# EAGLE board cyclops (EAGLE 6.5.0)
PCB: Cyclops r3.1; REVISION: 3.1
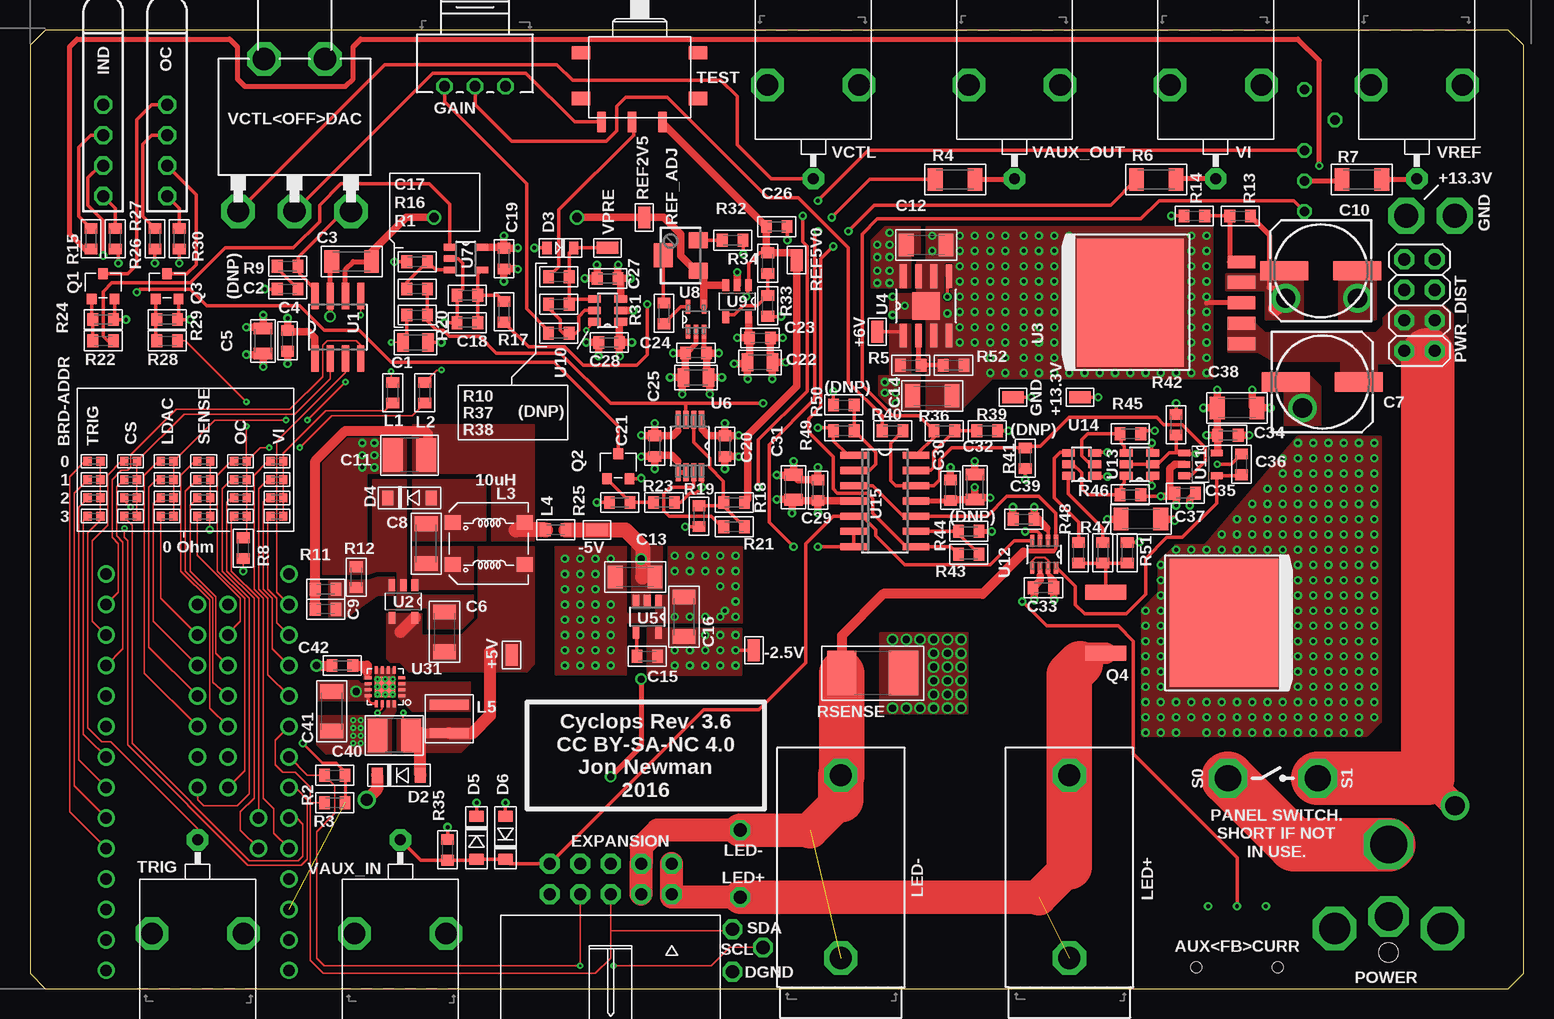
[diagram p5: board, top side]
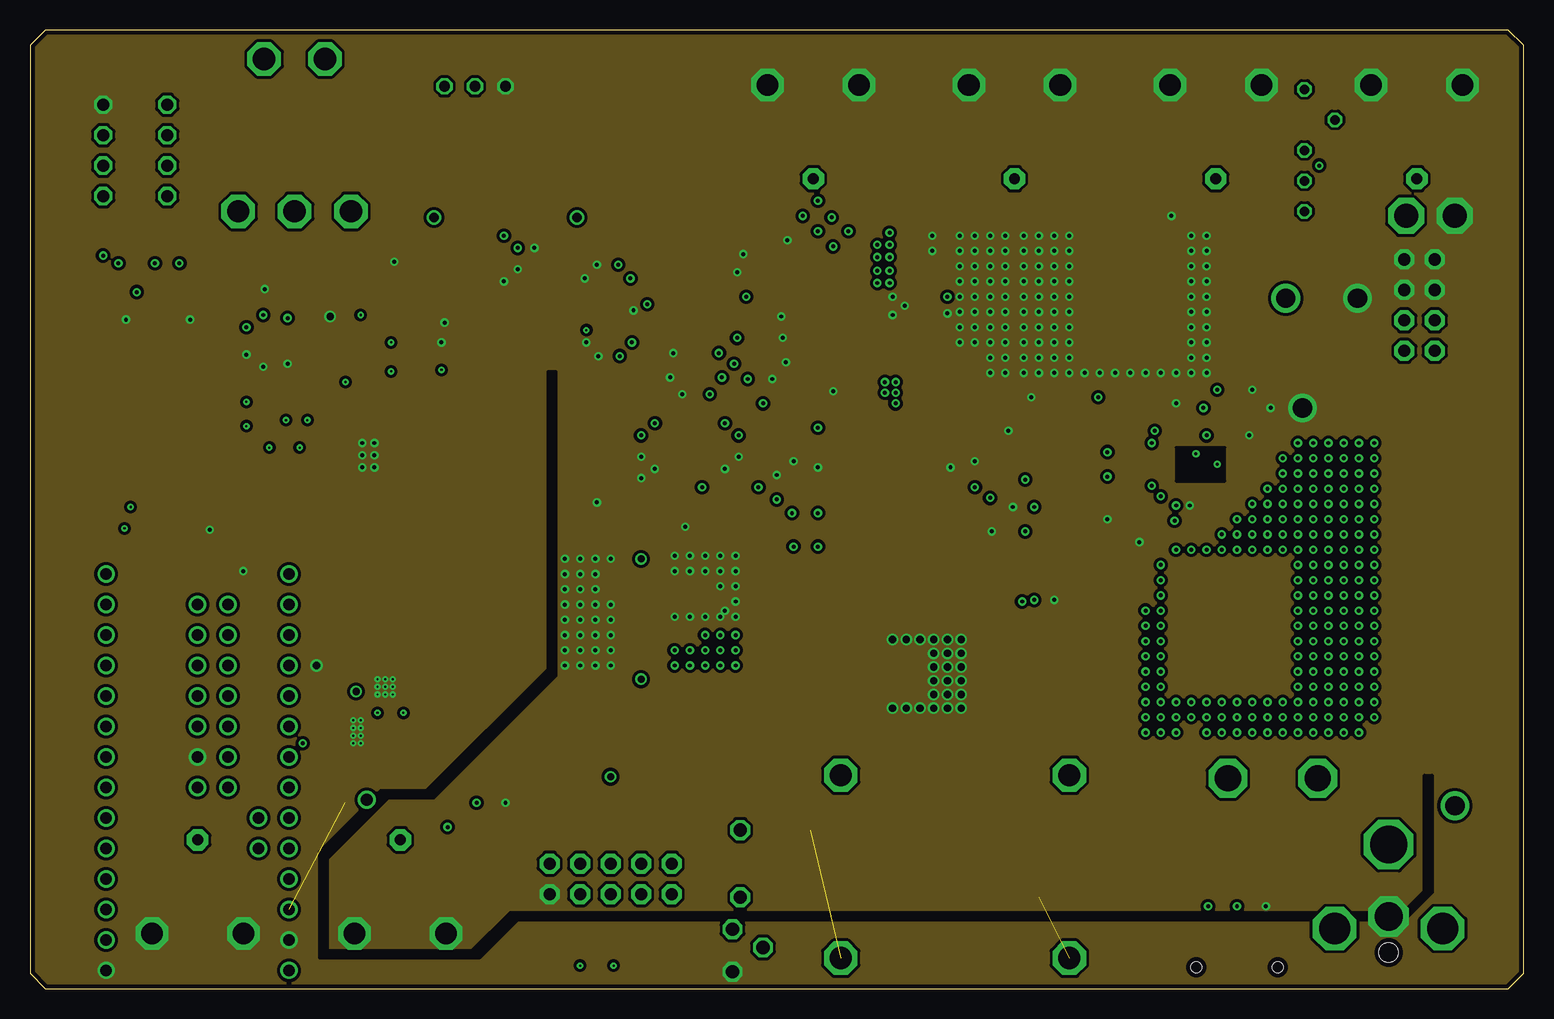
[diagram p6: board, inner layer Route2]
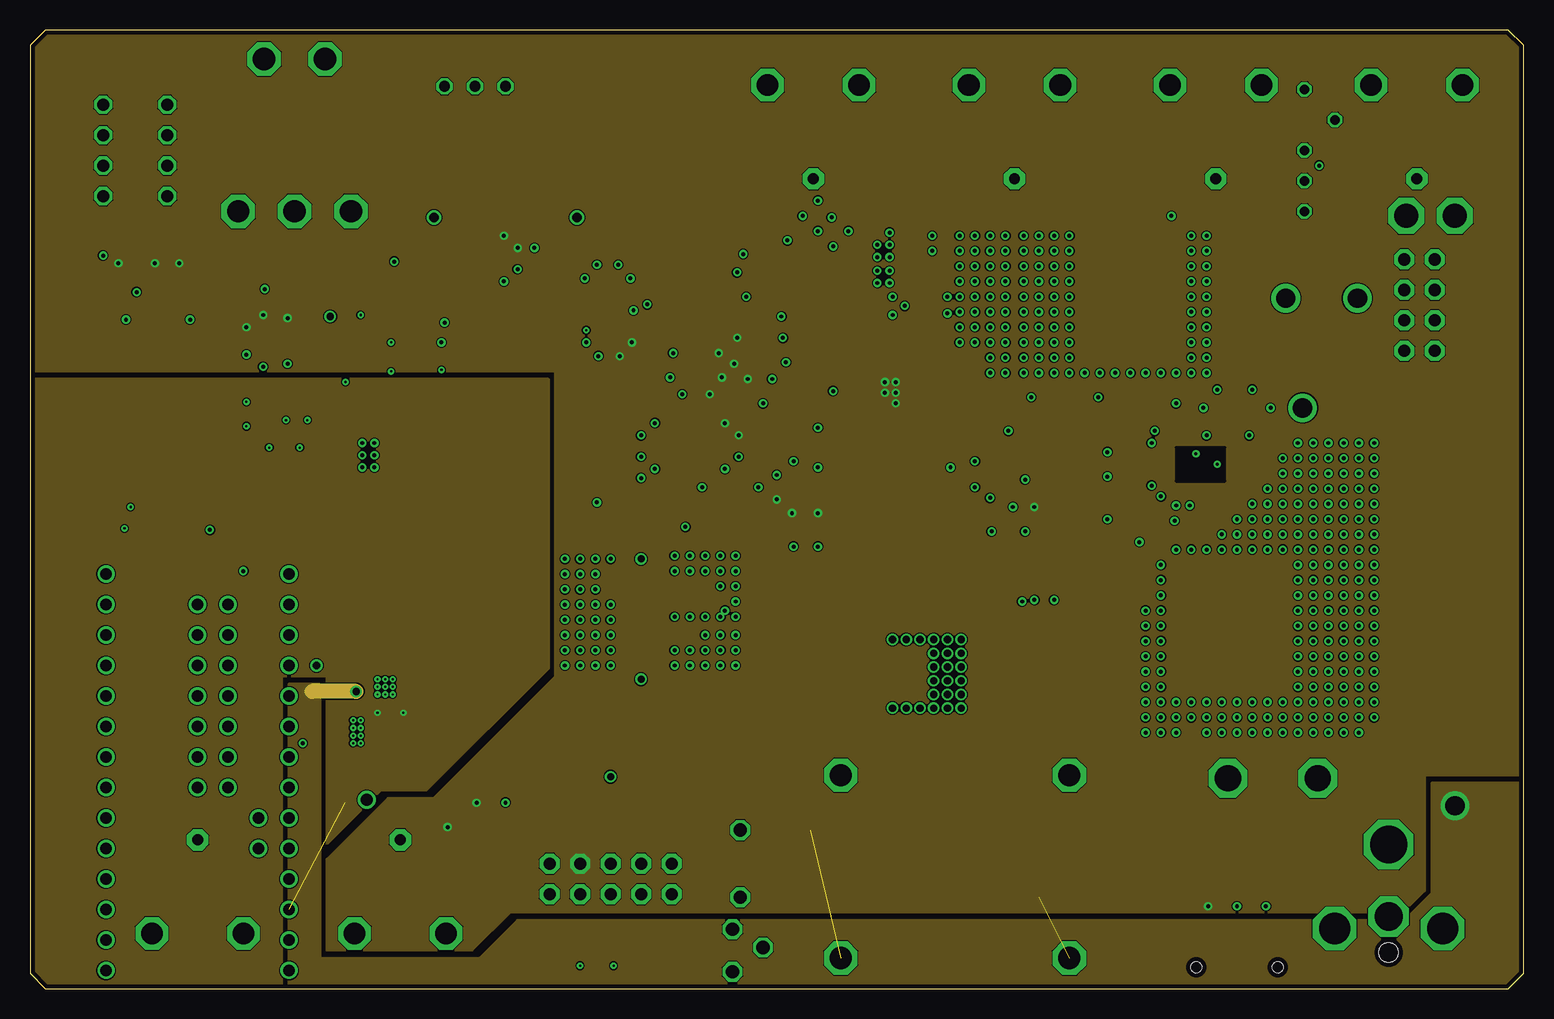
[diagram p7: board, inner layer Route15]
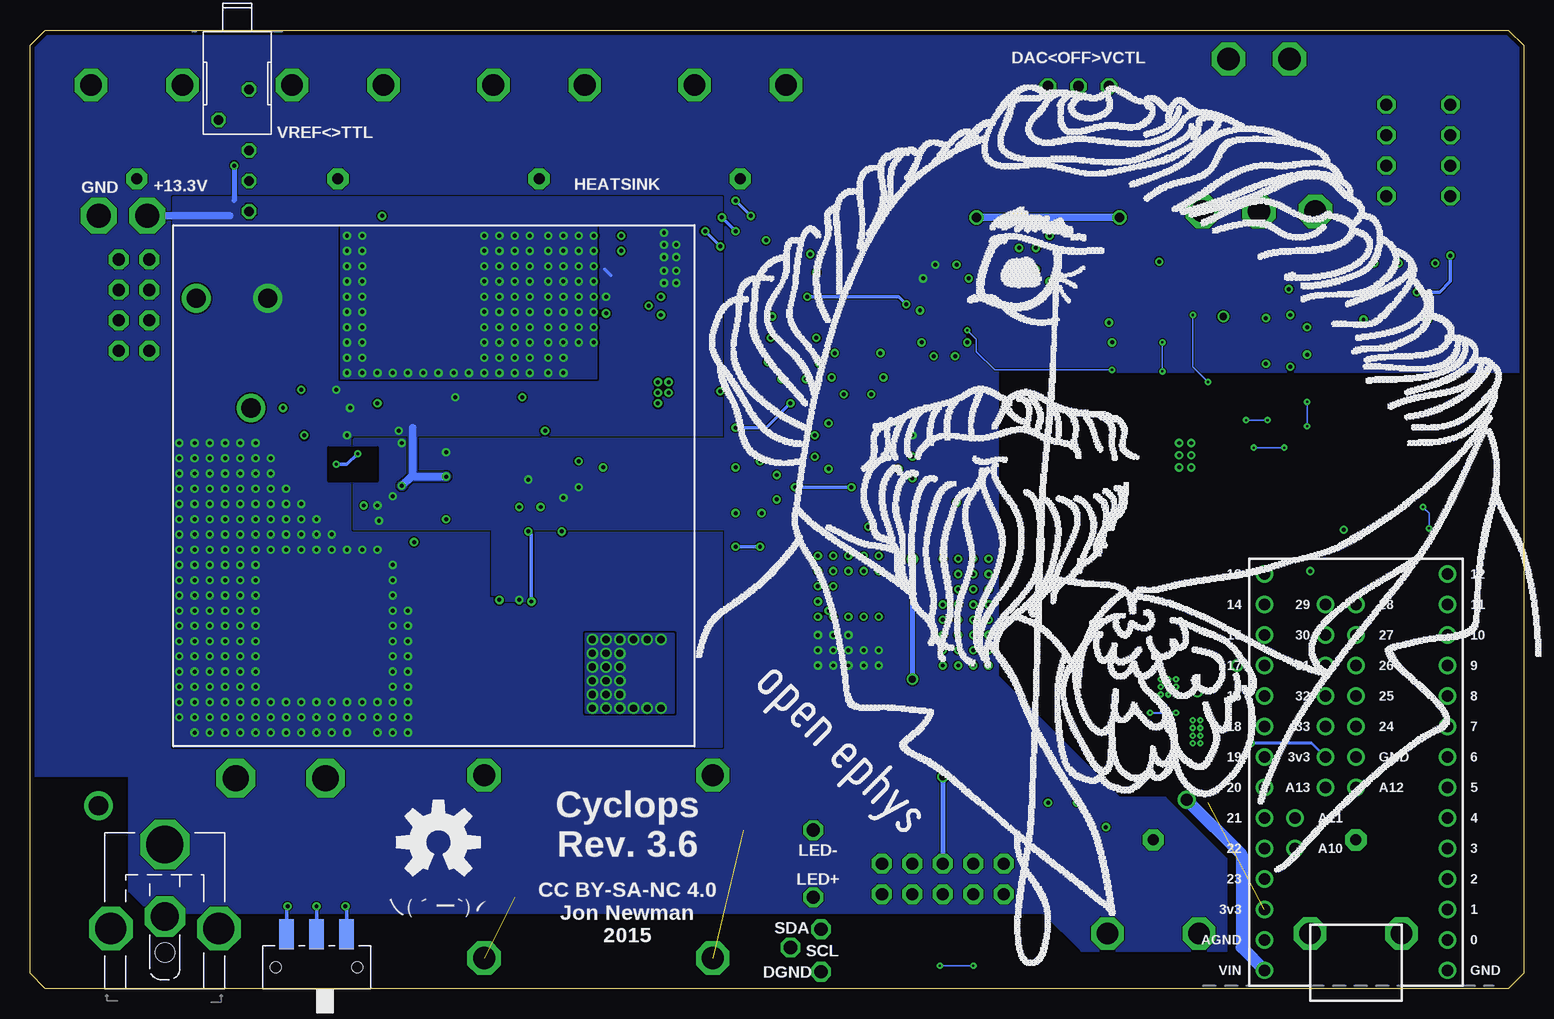
[diagram p8: board, bottom side, seen from below]

Size 124.46 x 79.88 mm. Coordinates in mm from the lower left corner, seen from the top.
Outline: 1.27,79.88 0,78.61 0,1.27 1.27,0 123.19,0 124.46,1.27 124.46,78.61 123.19,79.88 1.27,79.88
Copper layers (1+2*15+16): Top 0.0356mm / dielectric 1.5011mm / Route2 0.0356mm / dielectric 0.1499mm / Route15 0.0356mm / dielectric 0.2007mm / Bottom 0.0356mm
Design rules "circuit-hub-4-layer *": minimum track width 5mil, minimum drill 0.15mm, track to track 0.09mm, track to pad 0.09mm, pad to pad 0.09mm, via to via 0.09mm, smd to smd 0.09mm, copper to edge 15mil, drill to drill 0.15mm, minimum pad ring 7mil, minimum via ring 7mil, stop-mask expansion 4mil, vias tented up to drill 100mil, thermal gap 10mil
tKeepout: area 0,0 to 2.5,80; area 122.4,0 to 125,80
bKeepout: area 122.4,0 to 125,80

## Footprints (pad centres in the part's own frame; a part is rotated, then mirrored left to right if it is on the bottom)
RC0603 = smd 1 x 1.8: 1 0,0
JS102011SAQN = smd 1.2 x 2.5: 1 -2.5,2.75; 2 0,2.75; 3 2.5,2.75 | hole 0.9: -3.4,0; 3.4,0
0805 = smd 0.965 x 1.524: 1 -1.041,0; 2 1.041,0
0603 = smd 0.889 x 1.067: 1 -0.864,0; 2 0.864,0
1206 = smd 1.219 x 1.88: 1 -1.651,0; 2 1.651,0
153CLV-0807 = smd 4 x 1.6: + 3.05,0; - -3.05,0
1210 = smd 1.651 x 2.794: 1 -1.397,0; 2 1.397,0
SOD123 = smd 0.914 x 1.219: A -1.8,0; C 1.8,0
SOD-323 = smd 0.762 x 1.016: A -1.118,0; C 1.118,0
2X05-IDC = drill 1.016 pad 1.676 octagon: 1 -5.08,-2.54; 2 -5.08,0; 3 -2.54,-2.54; 4 -2.54,0; 5 0,-2.54; 6 0,0; 7 2.54,-2.54; 8 2.54,0; 9 5.08,-2.54; 10 5.08,0
3310C-001 = drill 0.9 octagon: 1 0,-2.54; 2 0,0; 3 0,2.54
569-011X-X00_LED_ARRAY = drill 1.016 octagon: A1 -6.35,0; A2 -1.27,0; C1 -8.89,0; C2 -3.81,0
0402 = smd 0.686 x 0.762: 1 -0.533,0; 2 0.533,0
CLS62 = smd 1.3 x 1.2: 1 -3,1.75; 2 -3,-1.75; 3 3,-1.75; 4 3,1.75
4020 = smd 0.813 x 3.251: 1 -1.181,0; 2 1.181,0
A-2107 = drill 1.854 octagon: 1 0,0; 2 15.24,0
PJ-063BH = drill 3.1 octagon: 1 0,-12 | drill 2.35 octagon: 2 0,-6 | drill 2.6 octagon: M1 -4.5,-5.004; M2 4.5,-5.004 | hole 1.6: 0,-3
2X04-BIG = drill 1.016 pad 1.676 octagon: 1 -3.81,-1.27; 2 -3.81,1.27; 3 -1.27,-1.27; 4 -1.27,1.27; 5 1.27,-1.27; 6 1.27,1.27; 7 3.81,-1.27; 8 3.81,1.27
SOT23-GSD = smd 0.8 x 0.9: D 0,0; G -0.95,-2.1; S 0.95,-2.1
TO-262_01 = smd 10.668 x 9.017: D 0,4.508 | smd 1.27 x 3.429: G -2.54,-5.347; S 2.54,-5.347
SM-42/43W = smd 1.3 x 1.6: 1 -1.27,-1.45; 3 1.27,-1.45 | smd 2 x 1.6: 2 0,1.45
2512 = smd 2.45 x 3.7: 1 -2.575,0; 2 2.575,0
CFPA = smd 1.7 x 0.7: 1 3.85,1.9; 2 3.85,-0.64; 3 3.85,-3.18 | smd 1.1 x 1.55: NC1 -1.905,4.875; NC2 -1.905,-4.875; NC3 1.905,-4.875; NC4 1.905,4.875
0731000105 = drill 0.914 pad 1.778 octagon: 1 0,12.395 | drill 1.803 octagon: 2 -3.81,4.597; 3 3.81,4.597
SO08 = smd 0.6 x 2.2: 1 -1.905,-2.6; 2 -0.635,-2.6; 3 0.635,-2.6; 4 1.905,-2.6; 5 1.905,2.6; 6 0.635,2.6; 7 -0.635,2.6; 8 -1.905,2.6
SOT95P310X175-5N = smd 1 x 0.55: 1 -1.35,0.95; 2 -1.35,0; 3 -1.35,-0.95; 4 1.35,-0.95; 5 1.35,0.95
5-DDPAK = smd 1.067 x 2.286: 1 -3.404,-9.271; 2 -1.702,-9.271; 3 0,-9.271; 4 1.702,-9.271; 5 3.404,-9.271 | smd 10.668 x 8.89: TAB 0,0
SOIC127P600X175-9N = smd 1.981 x 0.559: 1 -2.464,1.905; 2 -2.464,0.635; 3 -2.464,-0.635; 4 -2.464,-1.905; 5 2.464,-1.905; 6 2.464,-0.635; 7 2.464,0.635; 8 2.464,1.905 | smd 2.286 x 2.286: 9 0,0
SOT-23-5 = smd 0.55 x 1: 1 -0.95,-1.35; 2 0,-1.35; 3 0.95,-1.35; 4 0.95,1.35; 5 -0.95,1.35
SOP65P490X110-8N = smd 1.499 x 0.432: 1 -2.184,0.965; 2 -2.184,0.33; 3 -2.184,-0.33; 4 -2.184,-0.965; 5 2.184,-0.965; 6 2.184,-0.33; 7 2.184,0.33; 8 2.184,0.965
SOT65P210X110-5N = smd 1.168 x 0.356: 1 -1.041,0.66; 2 -1.041,0; 3 -1.041,-0.66; 4 1.041,-0.66; 5 1.041,0.66
SOT23-6 = smd 0.65 x 1.06: 1 -0.95,-1.1; 2 0,-1.1; 3 0.95,-1.1; 4 0.95,1.1; 5 0,1.1; 6 -0.95,1.1
SOT65P300X175-N = smd 1.016 x 0.356: 1 -1.118,0.66; 2 -1.118,0; 3 -1.118,-0.66; 4 -1.118,-1.31; 5 1.118,-1.31; 6 1.118,-0.66; 7 1.118,0; 8 1.118,0.66
SO14 = smd 0.6 x 2.2: 1 -3.81,-2.6; 2 -2.54,-2.6; 3 -1.27,-2.6; 4 0,-2.6; 5 1.27,-2.6; 6 2.54,-2.6; 7 3.81,-2.6; 8 3.81,2.6; 9 2.54,2.6; 10 1.27,2.6; 11 0,2.6; 12 -1.27,2.6; 13 -2.54,2.6; 14 -3.81,2.6
VQFN16 = smd 0.6 x 0.25: 1 -1.4,0.75; 2 -1.4,0.25; 3 -1.4,-0.25; 4 -1.4,-0.75; 9 1.4,-0.75; 10 1.4,-0.25; 11 1.4,0.25; 12 1.4,0.75 | smd 0.25 x 0.6: 5 -0.75,-1.4; 6 -0.25,-1.4; 7 0.25,-1.4; 8 0.75,-1.4; 13 0.75,1.4; 14 0.25,1.4; 15 -0.25,1.4; 16 -0.75,1.4 | smd 1.7 x 1.7: PAD 0,0
TEENSY_3.1_CYCLOPS = drill 0.965: 0 7.62,3.81; 1 7.62,6.35; 2 7.62,8.89; 3 7.62,11.43; 3.3V -7.62,6.35; 3.3V2 -2.54,19.05; 4 7.62,13.97; 5 7.62,16.51; 6 7.62,19.05; 7 7.62,21.59; 8 7.62,24.13; 9 7.62,26.67; 10 7.62,29.21; 11 7.62,31.75; 12 7.62,34.29; 13 -7.62,34.29; 14/A0 -7.62,31.75; 15/A1 -7.62,29.21; 16/A2 -7.62,26.67; 17/A3 -7.62,24.13; 18/A4 -7.62,21.59; 19/A5 -7.62,19.05; 20/A6 -7.62,16.51; 21/A7 -7.62,13.97; 22/A8 -7.62,11.43; 23/A9 -7.62,8.89; 24 0,21.59; 25 0,24.13; 26 0,26.67; 27 0,29.21; 28 0,31.75; 29 -2.54,31.75; 30 -2.54,29.21; 31 -2.54,26.67; 32 -2.54,24.13; 33 -2.54,21.59; A10 -5.08,11.43; A11 -5.08,13.97; A12 0,16.51; A13 -2.54,16.51; AGND -7.62,3.81; GND 7.62,1.27; GND2 0,19.05; VIN -7.62,1.27
2M1-SP1-T2-B4-M6RE = drill 1.854 octagon: 1 12.192,4.699; 2 12.192,0; 3 12.192,-4.699; M1 -0.508,-2.54; M2 -0.508,2.54
AS12A*_SPDT = drill 0.8 octagon: MECH1 -10.16,0.991; MECH2 -7.62,-1.549; P1 0,0.991; P2 -2.54,0.991; P3 -5.08,0.991

## Placement (x,y rotation side)
+5V  RCU-0C  [RC0603]  40.13,27.81 0 top
+6V  RCU-0C  [RC0603]  70.61,54.74 180 top
+13.3V  RCU-0C  [RC0603]  87.5,49.28 90 top
-2.5V  RCU-0C  [RC0603]  60.33,28.19 180 top
-5V  RCU-0C  [RC0603]  47.24,38.23 90 top
AUX<FB>CURR  JS102  [JS102011SAQN]  100.58,1.78 0 bottom
C1  1uF  [0805]  32.13,53.85 0 top
C2  [0603]  21.47,58.29 180 top
C3  10uF  [1206]  26.8,60.59 180 top
C4  .1uF  [0603]  21.46,53.98 270 top
C5  1uF  [0805]  19.42,53.98 270 top
C6  4.7uF  [1206]  34.54,29.72 90 top
C7  100uF  [153CLV-0807]  107.7,50.55 0 top
C8  1uF  [1206]  33.02,37.08 90 top
C9  220pF  [0603]  24.64,31.62 0 top
C10  100uF  [153CLV-0807]  107.57,59.82 180 top
C11  22uF  [1210]  31.62,44.45 180 top
C12  10uF  [1206]  74.68,61.98 0 top
C13  10uF  [1206]  50.42,34.29 0 top
C14  10uF  [1206]  75.18,49.4 0 top
C15  10nF  [0603]  51.44,27.69 0 top
C16  10uF  [1206]  54.48,30.99 270 top
C17  .1uF  [0603]  32.26,60.58 180 top
C18  .1uF  [0603]  36.45,55.5 180 top
C19  .1uF  [0603]  39.5,60.83 270 top
C20  .1uF  [0603]  57.91,45.21 270 top
C21  .1uF  [0603]  52.07,45.21 270 top
C22  1uF  [0805]  60.83,52.19 0 top
C23  .1uF  [0603]  60.83,54.22 0 top
C24  .1uF  [0603]  55.5,52.97 180 top
C25  1uF  [0805]  55.5,50.93 180 top
C26  .1uF  [0603]  62.23,63.5 0 top
C27  0.1uF  [0603]  48.13,59.18 180 top
C28  0.1uF  [0603]  48.26,53.85 180 top
C29  .1uF  [0603]  65.66,41.53 90 top
C30  .1uF  [0603]  76.71,41.53 90 top
C31  1uF  [0805]  63.63,41.78 90 top
C32  1uF  [0805]  78.74,41.78 90 top
C33  10nF  [0603]  84.45,33.4 0 top
C34  .1uF  [0603]  99.82,46.1 0 top
C35  .1uF  [0603]  96.27,41.27 0 top
C36  220pF  [0603]  100.97,43.69 90 top
C37  10uF  [1206]  92.58,39.12 180 top
C38  10uF  [1206]  100.58,48.39 0 top
C39  10nF  [0603]  82.8,39.12 180 top
C40  22uF  [1210]  30.35,21.08 180 top
C41  10uF  [1206]  25.15,23.11 270 top
C42  3.3nF  [0603]  26.04,26.92 180 top
D1  1N5819  [SOD123]  48.01,99.31 0 top  (outside the outline)
D2  1N5819  [SOD123]  30.73,17.78 180 top
D3  MM3Z5V1  [SOD-323]  44.2,61.72 0 top
D4  MBR0520L  [SOD123]  31.62,40.89 180 top
D5  STPS0560Z  [SOD123]  37.21,12.57 90 top
D6  STPS0560Z  [SOD123]  39.62,12.57 270 top
EXPANSION  PINH2X5_ICD-H  [2X05-IDC]  48.39,7.87 180 top
GAIN  1k  [3310C-001]  37.08,75.18 90 top
GND  RCU-0C  [RC0603]  81.92,49.28 270 top
HEATSINK  BDN17  [BDN17]  112.52,20.19 0 bottom
IND  569-0112-200  [569-011X-X00_LED_ARRAY]  6.1,64.77 270 top
J_ADDR0  0  [0402]  14.48,43.94 180 top
J_ADDR1  0  [0402]  14.48,42.42 180 top
J_ADDR2  0  [0402]  14.48,40.89 180 top
J_ADDR3  0  [0402]  14.48,39.37 180 top
J_CS0  0  [0402]  8.38,43.94 180 top
J_CS1  0  [0402]  8.38,42.42 180 top
J_CS2  0  [0402]  8.38,40.89 0 top
J_CS3  0  [0402]  8.38,39.37 0 top
J_LDAC0  0  [0402]  11.43,43.94 0 top
J_LDAC1  0  [0402]  11.43,42.42 180 top
J_LDAC2  0  [0402]  11.43,40.89 180 top
J_LDAC3  0  [0402]  11.43,39.37 180 top
J_OC0  0  [0402]  17.53,43.94 180 top
J_OC1  0  [0402]  17.53,42.42 180 top
J_OC2  0  [0402]  17.53,40.89 180 top
J_OC3  0  [0402]  17.53,39.37 180 top
J_T0  0  [0402]  5.33,43.94 0 top
J_T1  0  [0402]  5.33,42.42 0 top
J_T2  0  [0402]  5.33,40.89 0 top
J_T3  0  [0402]  5.33,39.37 0 top
J_VI0  0  [0402]  20.57,43.94 0 top
J_VI1  0  [0402]  20.57,42.42 0 top
J_VI2  0  [0402]  20.57,40.89 0 top
J_VI3  0  [0402]  20.57,39.37 0 top
L1  MPZ1608  [0603]  30.23,49.66 90 top
L2  MPZ1608  [0603]  32.89,49.66 270 top
L3  10uH  [CLS62]  38.23,37.08 0 top
L4  MPZ1608  [0603]  43.81,38.23 0 top
L5  XFL4020-222ME  [4020]  34.92,22.48 90 top
LED+  24.243.1  [A-2107]  86.61,2.54 90 top
LED-  24.243.2  [A-2107]  67.56,2.54 90 top
OC  569-0112-200  [569-011X-X00_LED_ARRAY]  11.43,64.77 270 top
POWER  PJ-063BH  [PJ-063BH]  113.22,0 180 bottom
PWR_DIST  PINH2X4  [2X04-BIG]  115.8,56.95 90 top
Q1  SSM3K324  [SOT23-GSD]  6.1,59.56 0 top
Q2  SSM3K324  [SOT23-GSD]  49.02,44.58 0 top
Q3  SSM3K324  [SOT23-GSD]  11.43,59.56 0 top
Q4  IRF510  [TO-262_01]  95,30.48 270 top
R1  110k  [0603]  32.26,56.13 180 top
R2  10k  [0603]  25.4,17.78 180 top
R3  10k  [0603]  25.4,15.49 180 top
R4  50  [1206]  77.09,67.44 180 top
R5  33k  [0603]  73.41,51.94 180 top
R6  50  [1206]  93.85,67.44 180 top
R7  50  [1206]  111,67.44 180 top
R8  110k  [0603]  17.78,36.7 270 top
R9  [0603]  21.47,60.2 0 top
R10  100  [0603]  44.07,59.31 0 top
R11  29.4k  [0603]  24.64,33.27 180 top
R12  10k  [0603]  27.18,34.29 270 top
R13  10k  [0603]  100.84,64.39 0 top
R14  1k  [0603]  97.03,64.39 0 top
R15  2.2k  [0603]  5.08,62.48 270 top
R16  10k  [0603]  32.26,58.29 0 top
R17  40k  [0603]  39.5,56.39 90 top
R18  100k  [0603]  58.67,40.51 0 top
R19  100  [0603]  55.75,39.37 90 top
R20  10k  [0603]  36.45,57.78 180 top
R21  100k  [0603]  58.67,38.48 180 top
R22  1k  [0603]  6.1,53.98 0 top
R23  1k  [0603]  52.83,40.51 0 top
R24  100k  [0603]  6.1,55.75 180 top
R25  100k  [0603]  49.15,40.51 0 top
R26  1k  [0603]  10.41,62.48 270 top
R27  1k  [0603]  7.11,62.48 270 top
R28  1k  [0603]  11.43,53.98 0 top
R29  100k  [0603]  11.43,55.75 180 top
R30  1k  [0603]  12.45,62.48 270 top
R31  470  [0603]  52.83,56.27 270 top
R32  1k  [0603]  58.55,62.36 180 top
R33  1k  [0603]  61.47,56.9 270 top
R34  1k  [0603]  61.47,60.45 270 top
R35  220k  [0603]  34.8,11.56 90 top
R36  0  [0603]  76.2,46.48 180 top
R37  0  [0603]  44.07,57.02 0 top
R38  2.2k  [0603]  44.07,54.61 0 top
R39  [0603]  79.76,46.48 0 top
R40  1k  [0603]  71.88,46.48 0 top
R41  220k  [0603]  82.93,44.2 90 top
R42  2.2k  [0603]  95.5,46.99 90 top
R43  0  [0603]  78.22,36.2 180 top
R44  [0603]  78.22,38.1 0 top
R45  2.2k  [0603]  91.69,46.23 180 top
R46  2.2k  [0603]  91.69,41.15 0 top
R47  0.5  [0603]  89.41,36.32 270 top
R48  0.5  [0603]  87.38,36.32 270 top
R49  0  [0603]  67.82,46.48 180 top
R50  [0603]  67.82,48.64 180 top
R51  10k  [0603]  91.44,36.32 270 top
R52  4.7k  [0603]  76.96,51.94 180 top
REF2V5  RCU-0C  [RC0603]  51.18,64.27 0 top
REF5V0  RCU-0C  [RC0603]  63.88,60.7 180 top
REF_ADJ  10k  [SM-42/43W]  54.23,61.09 90 top
RSENSE  1R0,2W  [2512]  70.22,26.29 180 top
TEST  CFPA  [CFPA]  50.81,76.07 270 top
TRIG  0731000105  [0731000105]  13.97,0 0 top
U1  MCP4921  [SO08]  25.65,55.12 0 top
U2  LT1931  [SOT95P310X175-5N]  31.11,32.26 270 top
U3  LT1764A  [5-DDPAK]  91.69,57.15 90 top
U4  BD00IA5WEFJ  [SOIC127P600X175-9N]  74.68,56.9 90 top
U5  TPS72325  [SOT-23-5]  51.44,30.99 180 top
U6  LT1711  [SOP65P490X110-8N]  54.99,45.21 270 top
U7  TLV3701  [SOT-23-5]  36.32,60.83 270 top
U8  ADR03  [SOT65P210X110-5N]  55.5,55.76 90 top
U9  LT1880  [SOT95P310X175-5N]  58.93,57.28 270 top
U10  ADG1201  [SOT23-6]  48.13,56.52 90 top
U11  THS4281  [SOT95P310X175-5N]  97.54,43.69 0 top
U12  MAX4564  [SOT65P300X175-N]  84.84,36.2 270 top
U13  ZXTD  [SOT23-6]  92.46,43.69 90 top
U14  ZXTD  [SOT23-6]  87.63,43.69 90 top
U15  OPA1664  [SO14]  71.24,40.64 270 top
U31  TPS62153  [VQFN16]  29.59,25.15 180 top
U$30  OPEN_EPHYS_LOGO  [OPEN_EPHYS_LOGO]  65.57,24.6 315 bottom
U$56  [CYCLOPS_LOGO]  38.01,38.35 0 bottom
U$60  [OSHW-LOGO-L]  90.42,12.19 0 bottom
UC  TEENSY_3.2  [TEENSY_3.1_CYCLOPS]  13.97,0.25 0 bottom
VAUX_IN  0731000105  [0731000105]  30.86,0 0 top
VAUX_OUT  0731000105  [0731000105]  82.04,79.88 180 top
VCTL  0731000105  [0731000105]  65.28,79.88 180 top
VCTL<OFF>DAC  100-SP3  [2M1-SP1-T2-B4-M6RE]  22.05,76.96 270 top
VI  0731000105  [0731000105]  98.81,79.88 180 top
VPRE  TPTP16R  [RC0603]  48.13,61.72 90 top
VREF  0731000105  [0731000105]  115.57,79.88 180 top
VREF<>TTL  AS12AC  [AS12A*_SPDT]  107.19,64.77 270 bottom

## Tracks (layer width: path | path; a pad name or v marks a point on that pad's centre or on a via)
+3V3  (via drill 0.33)  (1 unrouted)
  Top 0.254: v22.73,20.45 24.38,18.8 25.53,18.8 26.26,18.06 R2.1 R3.1
  Bottom 0.254: UC.3.3V2 17.65,20.45 v22.73,20.45
+5V  (via drill 0.18)
  Top 0.178: 31.11,21.46 v31.11,22.99 | v28.96,22.99 29.34,23.37 U31.14
  Top 0.813: 32.53,21.3 L5.1
  Top 1.016: 30.88,29.72 U2.5 | D2.A 32.53,21.3 | L5.1 36.89,21.3 38.35,22.76 38.35,28.07
  Bottom 0.178: v31.11,22.99 v28.96,22.99
  pour Top (no thermals): 30.61,22.48 30.61,19.68 35.89,19.68 36.7,20.5 36.7,22.48
  pour Top (no thermals): 37.34,36.83 42.04,36.83 42.04,27.05 41.4,26.42 31.62,26.42 30.86,27.18 30.08,27.18 29.72,27.54 29.72,31.24 32.64,31.24 32.64,29.46 35.96,29.46 37.34,30.84
  pour Route15 (rank 2): 43.18,50.8 43.18,26.67 33.02,16.51 29.21,16.51 24.77,12.06 24.77,26.04 20.95,26.04 20.95,-1.27 -1.27,-1.27 -1.27,50.8
+6V  (via drill 0.33)
  Top 0.254: 56.52,50.93 56.39,50.8
  Top 0.279: v7.37,60.45 7.37,61.37 R27.2 | v12.45,60.45 R30.2 | D5.C v37.21,15.49 | 56.39,52.96 C24.1 | +6V.1 72.47,54.74 U4.1 | R26.2 v10.41,60.45 | 21.48,54.86 21.46,54.86
  Top 0.305: U12.2 84.84,38.23 84.71,38.35 | R35.2 v34.8,13.46 | 56.52,50.93 C25.1
  Top 0.406: 49.02,53.75 C28.1 | 56.16,53.17 C24.1 56.16,52.97 U8.3 | U6.1 56.01,47.35 56.01,46.61
  Top 0.61: 21.48,54.86 C4.1 21.56,54.74 23.24,54.74 23.75,54.23 U1.1 | 84.71,38.35 84.07,39.12 C39.1 83.69,39.14 v83.69,40.13 | C19.1 39.42,61.77 39.42,61.78 U7.5 | C29.1 v65.66,39.62 | U15.4 67.18,40.64 C29.1 | C31.1 63.7,40.66 C29.1 | 56.26,53.07 C24.1 v57.4,52.97 v57.4,52.96 | v59.82,50.8 59.79,50.83 C22.1 | v58.67,52.07 59.79,52.07 C22.1 | v58.93,54.23 C23.1 | C22.1 59.97,52.19 C23.1 | U9.5 59.88,54.31 C23.1 | v57.66,50.93 v57.65,50.93 C25.1 | v56.64,49.53 56.64,50.93 | 56.39,51.18 56.39,52.96 | v39.5,62.74 C19.1 | v40.64,61.72 40.64,61.7 C19.1 | v57.91,47.12 C20.1 | v59.05,46.1 59.03,46.08 C20.1 | 56.01,46.61 56.54,46.08 C20.1 | v49.15,52.7 49.12,52.73 C28.1 | v50.16,53.85 C28.1 | U10.1 49.12,55.46 C28.1 | v62.23,40.77 63.5,40.77 v63.5,39.62 | v18.03,55.12 19.42,55.12 C5.1 | v21.46,55.88 21.46,54.86 | v19.43,56.13 19.43,54.99
  Bottom 0.279: v98.17,6.86 98.08,6.86 AUX<FB>CURR.3
  other vias: 71.25,50.55 72.14,50.55 72.14,49.66 71.25,49.66 72.14,48.77
  pour Top (no thermals): 70.74,51.05 70.74,49.51 72.11,48.13 74.17,48.13 74.17,51.18 73.41,51.18 73.41,55.37 71.63,55.37 71.63,51.05
  pour Route15 (rank 3, no thermals): 29.84,15.88 33.66,15.88 43.81,26.04 43.81,51.44 -1.27,51.44 -1.27,81.28 125.09,81.28 125.09,17.78 116.2,17.78 116.2,8.15 114.41,6.35 40.01,6.35 36.83,3.17 24.77,3.17 24.77,10.79
+13.3V  (via drill 0.33, 1.6 pad 0.33, 2)
  Top 0.279: 4.83,61.37 R15.2 | +13.3V.1 v89.03,49.28 | U4.5 76.45,59.23 v76.45,57.66
  Top 0.305: C10.+ | R45.1 92.81,46.48 v93.73,46.48 | v89.79,42.67 88.8,42.67 U14.1 | U13.1 93.47,42.65 v93.47,41.91
  Top 0.406: 4.83,61.37 3.3,62.89 3.3,78.49 3.94,79.12 16.64,79.12 17.27,78.49 17.27,75.82 17.91,75.18 26.29,75.18 26.92,75.82 26.92,78.49 27.56,79.12 105.66,79.12 107.44,77.34 v107.44,68.58 | R13.2 103.25,62.84 103.25,58.42 104.01,58.42 104.65,57.78 v104.65,57.53
  Top 0.61: U11.5 98.96,44.71 C34.1 | C34.1 98.93,46.13 C38.1 v98.93,49.91 | v98.04,46.1 C34.1 | v97.79,48.39 98.81,48.39
  Top 1.27: 103.81,56.69 v104.65,57.53
  Bottom 0.279: 76.07,59.44 76.58,59.94 | 76.58,57.53 v76.45,57.66
  Bottom 0.406: v107.44,68.58 107.44,65.66
  Bottom 0.61: v89.79,42.67 92.71,42.67 | 92.71,42.67 v93.47,41.91 | 92.71,42.67 92.56,42.82 92.56,46.74 | v114.68,64.39 107.82,64.39
  other vias: 110.74,31.5 112.01,37.85 110.74,37.85 109.47,37.85 108.2,37.85 106.93,37.85 105.66,37.85 104.39,37.85 103.12,37.85 101.85,37.85 100.58,37.85 99.31,37.85 101.85,40.39 112.01,36.58 110.74,36.58 109.47,36.58 108.2,36.58 106.93,36.58 105.66,36.58 104.39,36.58 103.12,36.58 101.85,36.58 100.58,36.58 99.31,36.58 98.04,36.58 105.66,35.31 106.93,35.31 108.2,35.31 109.47,35.31 110.74,35.31 112.01,35.31 112.01,34.04 110.74,34.04 109.47,34.04 108.2,34.04 106.93,34.04 105.66,34.04 112.01,39.12 110.74,39.12 109.47,39.12 108.2,39.12 106.93,39.12 105.66,39.12 104.39,39.12 103.12,39.12 101.85,39.12 100.58,39.12 106.93,42.93 105.66,42.93 105.66,32.77 106.93,32.77 108.2,32.77 109.47,32.77 110.74,32.77 112.01,32.77 112.01,31.5 109.47,31.5 108.2,31.5 106.93,31.5 105.66,31.5 105.66,30.23 106.93,30.23 108.2,30.23 109.47,30.23 110.74,30.23 112.01,30.23 112.01,28.96 110.74,28.96 109.47,28.96 108.2,28.96 106.93,28.96 105.66,28.96 105.66,27.69 106.93,27.69 108.2,27.69 109.47,27.69 110.74,27.69 112.01,27.69 112.01,26.42 110.74,26.42 109.47,26.42 108.2,26.42 106.93,26.42 105.66,26.42 105.66,25.15 106.93,25.15 108.2,25.15 109.47,25.15 110.74,25.15 112.01,25.15 112.01,23.88 110.74,23.88 109.47,23.88 108.2,23.88 106.93,23.88 105.66,23.88 104.39,23.88 103.12,23.88 101.85,23.88 100.58,23.88 99.31,23.88 98.04,23.88 98.04,22.61 99.31,22.61 100.58,22.61 101.85,22.61 103.12,22.61 104.39,22.61 105.66,22.61 106.93,22.61 108.2,22.61 109.47,22.61 110.74,22.61 112.01,22.61 94.23,31.5 94.23,34.04 94.23,35.31 95.5,36.58 96.77,36.58 94.23,32.77 95.5,23.88 95.5,22.61 96.77,22.61 96.77,23.88 94.23,22.61 94.23,30.23 94.23,28.96 94.23,27.69 94.23,26.42 94.23,25.15 94.23,23.88 103.12,40.39 104.39,40.39 105.66,40.39 106.93,40.39 108.2,40.39 109.47,40.39 110.74,40.39 112.01,40.39 112.01,41.66 110.74,41.66 109.47,41.66 108.2,41.66 106.93,41.66 105.66,41.66 104.39,41.66 103.12,41.66 104.39,42.93 92.96,22.61 92.96,23.88 92.96,25.15 92.96,26.42 92.96,27.69 92.96,28.96 92.96,30.23 92.96,31.5 108.2,42.93 109.47,42.93 110.74,42.93 112.01,42.93 112.01,44.2 110.74,44.2 109.47,44.2 108.2,44.2 106.93,44.2 105.66,44.2 105.66,45.47 106.93,45.47 108.2,45.47 109.47,45.47 110.74,45.47 112.01,45.47 104.39,44.2 98.04,21.34 99.31,21.34 100.58,21.34 101.85,21.34 103.12,21.34 104.39,21.34 105.66,21.34 106.93,21.34 108.2,21.34 109.47,21.34 110.74,21.34 95.5,21.34 94.23,21.34 92.96,21.34 71.63,62.99 70.61,61.98 70.61,60.96 70.61,59.82 70.61,58.8 71.63,61.98 71.63,60.96 71.63,59.82 71.63,58.8
  pour Bottom (isolate 0.127, rank 2, no thermals): 66.8,65.91 112.52,65.91 112.52,20.19 66.8,20.19
  pour Top: 112.52,45.97 112.52,22.22 111.39,21.08 92.71,21.08 92.71,31.62 94.11,33.02 94.11,35.56 95.5,36.96 97.92,36.96 105.66,45.97
  pour Top (no thermals): 103,55.75 103,58.17 99.69,58.17 99.69,59.56 106.05,59.56 106.05,55.75
  pour Top (no thermals): 70.1,58.42 73.41,58.42 73.41,61.21 74.17,61.21 74.17,63.5 71.27,63.5 70.1,62.33
+15V  (via drill 0.6, 1.6, 2.2 pad 0.33)
  Top 0.254: U31.13 28.48,23.75 28.19,24.03 U31.12
  Top 0.305: 116.35,53.86
  Top 2.184: v118.75,15.24 116.48,17.5 116.48,17.78
  Top 4.445: v107.31,17.53 116.48,17.53 116.48,17.78 116.48,52.81
  Route15 1.27: v27.19,24.77 v27.18,24.77 23.5,24.77
  pour Top (no thermals): 99.82,55.88 99.82,53.09 102.36,53.09 103.63,52.32 109.22,52.32 109.22,50.04 112.27,50.04 112.27,52.07 118.62,52.32 118.62,56.13 117.86,56.9 113.79,56.9 112.78,55.88 112.78,55.24 112.14,54.61 102.92,54.61 102.11,55.42 102.11,55.88
  pour Top (no thermals): 28.32,25.4 27.56,25.4 27.3,25.65 23.88,25.65 23.88,24 28.32,24
  pour Route15: 116.84,17.14 125.09,17.14 125.09,-1.27 21.59,-1.27 21.59,25.4 24.13,25.4 24.13,2.54 37.47,2.54 40.64,5.71 114.55,5.71 116.84,8
  pour Top (no thermals): 28.32,25.4 27.56,25.4 27.3,25.65 23.88,25.65 23.88,24 28.32,24
-2.5V  (via drill 0.33)
  Top 0.279: -2.5V.1 v58.8,28.19
  Top 0.305: R41.1 v82.93,42.42 | R46.2 92.69,41.02 v94.23,41.02 | U12.6 84.18,34.44 84.2,34.42 | v89.79,44.7 88.8,44.7 U14.3 | U13.3 93.47,44.72 v93.47,45.47
  Top 0.406: U15.11 76.58,40.64 C30.1 | U6.4 54.03,46.53 53.98,46.48
  Top 0.61: C30.1 76.58,40.74 C32.1 78.74,40.89 | v78.74,41.78 78.74,40.89 | 78.74,40.89 v80.01,40.89 | 95,41.27 95,43.31 95.38,43.69 U11.2 | 95.25,41.27 95,41.27 | v94.23,41.02 95,41.02 95.25,41.27 | 95,41.27 95,41.15 95.12,41.02 | 95.25,41.27 95.38,41.27 | 84.2,34.42 84.2,34.01 C33.1 83.69,33.3 v83.69,32.38 | v95.5,40.26 95.5,41.15 95.38,41.27 | C37.1 95.25,39.12 v95.38,38.99 | 95.38,41.27 C35.1 | v50.93,46.1 50.95,46.08 C21.1 | v52.07,47.12 C21.1 | 53.98,46.48 53.57,46.08 C21.1 | v50.04,59.18 C27.1 | v49.02,60.33 49,60.3 C27.1 | C27.1 arc-90 49.23,58.95 U10.3
  other vias: 57.53,29.46 57.53,28.19 57.53,26.92 56.26,29.46 56.26,28.19 56.26,26.92 58.8,29.46 58.8,26.92 54.99,26.92 53.72,26.92 53.72,28.19 54.99,28.19
  pour Bottom (isolate 0.254, no thermals): 65.15,45.72 97.41,45.72 97.41,38.35 85.85,38.35 85.85,32.38 83.06,32.38 83.06,38.35 65.15,38.35
  pour Top (no thermals): 59.31,29.97 51.44,29.97 51.44,26.16 59.31,26.16
  pour Bottom (rank 3, no thermals): 29.84,15.88 33.66,15.88 43.81,26.04 43.81,51.44 -1.27,51.44 -1.27,81.28 125.09,81.28 125.09,17.78 116.2,17.78 116.2,8.15 114.41,6.35 40.01,6.35 36.83,3.17 24.77,3.17 24.77,10.79
-5V  (via drill 0.6)
  Top 0.406: v50.93,25.78 50.93,20.19 v48.39,17.65
  Top 1.27: L4.2 -5V.1 49.62,38.23 51.05,36.79 51.05,34.29
  Bottom 0.406: v50.93,35.81 v50.93,25.78 | v48.39,17.65 EXPANSION.5
  pour Top (no thermals): 51.69,33.27 52.7,33.27 52.7,36.83 50.16,36.83 50.16,31.75 51.69,31.75
_VREF
  Top 0.279: U11.3 96.71,42.74 97.92,43.94 97.92,45.09 96.01,46.99 94.49,46.99 93.88,47.6 86.59,47.6 84.2,45.21 82.93,45.21 | R40.2 71.73,45.47 71.73,42.32 72.14,41.91 U15.12 75.31,41.91 75.82,42.42 75.82,44.07 76.81,45.06 R41.2
  Top 0.305: 82.93,45.21 R41.2
ADDR0
  Top 0.127: UC.33 14.99,23.37 14.99,32.38 12.57,34.8 12.57,42.8 13.72,43.94 J_ADDR0.2
ADDR1
  Top 0.127: UC.32 15.24,25.53 15.24,32.51 12.95,34.8 12.95,41.43 J_ADDR1.2
ADDR2
  Top 0.127: UC.31 15.49,27.94 15.49,32.64 13.34,34.8 13.34,40.28 J_ADDR2.2
ADDR3
  Top 0.127: UC.30 16.51,29.59 17.53,30.61 17.53,32.51 13.95,36.09 J_ADDR3.2
COM
  Top 0.279: 85.57,35.08 87.12,33.53 87.12,32 87.88,31.24 91.36,31.24 92.96,32.85 92.96,35.81 94.74,37.59 96.01,37.59 98.89,40.47 U11.4 100.88,42.74
  Top 0.305: U12.8 85.57,35.08 | 100.88,42.74 C36.1
COMP+
  Top 0.279: U7.3 33.82,59.88 C17.1 31.39,58.85 R16.1
CS
  Top 0.127: 24.89,52.52 24.89,53.34 | U1.2 25.02,50.83 22.07,47.88 12.85,47.88 J_CS0.1 J_CS1.1 J_CS2.2 J_CS3.2
  Top 0.178: 24.89,53.34 24.89,53.47 25.02,53.47
  Top 0.254: 24.89,52.52 U1.2
CS0
  Top 0.127: UC.10 5.21,30.61 5.21,37.34 6.48,38.61 6.48,42.8 7.62,43.94 J_CS0.2
CS1
  Top 0.127: J_CS1.2 7.24,41.81 7.24,37.72 7.75,37.21 7.75,28.32 UC.9
CS2  (via drill 0.18)
  Top 0.127: UC.20/A6 22.23,16.76 22.23,16.64 23.11,15.75 23.11,10.79 22.61,10.29 18.16,10.29 8.13,20.32 8.13,37.34 7.85,37.62 7.85,38.2 v7.87,38.35 | v8.38,40.13 7.85,40.66 J_CS2.1
  Bottom 0.127: v7.87,38.35 7.87,39.62 v8.38,40.13
CS3
  Top 0.127: UC.21/A7 22.23,14.22 22.73,13.72 22.73,11.05 22.35,10.67 18.29,10.67 8.51,20.45 8.51,38.61 7.85,39.27 J_CS3.1
DACA
  Top 0.279: VCTL<OFF>DAC.1 26.14,64.77 22.33,60.96 R9.2 22.48,60.05 22.48,59.56 23.75,58.29 U1.8
GND  (via drill 0.15, 0.33, 0.33 pad 0.33, 0.6, 0.6 pad 0.61, 0.6 pad 1.02, 1.1, 1.6 pad 0.33, 2)
  Top 0.127: J_ADDR0.1 J_ADDR1.1 J_ADDR2.1 J_ADDR3.1 14.99,39.37 v14.99,38.23 | R8.2 v17.78,34.8
  Top 0.178: U12.5 83.53,35.65 83.82,35.94 84.58,35.94 84.84,35.69 U12.7
  Top 0.279: 48.2,40.43 R25.1 v47.24,40.51 | v8,55.75 R24.1 7.05,55.84 Q1.S | Q3.S 12.38,55.84 R29.1 v13.34,55.75 | 25.02,61.09 25.27,61.09 25.27,60.59 C3.2 | v62.61,56.01 61.49,56.01 R33.2 | R32.1 59.44,62.34 v59.44,61.21 | U7.2 35.69,60.83 36.07,60.45 36.07,58.27 R20.2 C18.2 v34.54,55.5 | R19.1 55.73,38.48 v54.61,38.48 | C17.2 v30.35,60.58 | C1.2 v34.29,53.85 | v19.56,58.29 C2.2 | D6.A v39.62,15.49 | C26.2 63.12,63.48 v63.12,62.36 | Q2.S 50.86,42.48 v50.93,42.55 | v66.93,49.78 66.95,49.76 R50.2 | GND.1 v83.44,49.28 | C5.2 19.43,52.93 19.43,52.83 | 21.46,53.09 C4.2 | 54.61,52.97 54.61,52.96 | 98.04,57.15 v98.04,57.66
  Top 0.305: C22.2 61.86,52.19 61.85,52.2 | R39.2 v81.53,46.48 | R42.2 v95.5,48.77 | R51.1 92.43,37.19 v92.46,37.21 | U12.7 84.84,34.54 84.96,34.42 | R14.1 v95.12,64.39 | D3.A v42.04,61.72
  Top 0.406: U8.2 55.5,53.73 54.74,52.97 | R44.2 v80.14,38.1 | v25.02,56.01 U1.7 25.02,61.09 | 84.96,34.42 85.09,34.29 85.09,34.16 | 53.98,43.94 54.03,43.89 U6.5 U6.6 | U3.3 98.04,57.15
  Top 0.61: 61.85,51.94 61.85,52.2 61.7,52.2 C23.2 v62.74,54.23 | C30.2 v76.71,43.43 | C32.2 v78.74,43.94 | v63.63,43.94 C31.2 | v65.66,43.43 65.66,42.42 | 65.66,42.42 C29.2 | v62.23,42.8 63.63,42.8 64.01,42.42 65.66,42.42 | C37.2 v89.79,39.12 | v96.65,40.26 96.65,40.79 C35.2 | v103.38,48.39 C38.2 | C34.2 v101.6,46.1 | v85.34,32.38 85.32,32.41 C33.2 85.32,33.93 85.09,34.16 | C39.2 81.92,39.14 v81.92,40.13 | v61.85,50.8 61.87,50.83 C22.2 v62.99,52.2 | U9.2 v58.93,59.69 | v53.34,50.93 v53.35,50.93 C25.2 | v53.59,52.96 v53.6,52.97 54.61,52.97 C24.2 54.74,52.97 | v54.36,49.53 54.36,50.93 | 54.61,51.18 54.61,52.96 | v101.85,49.91 101.85,48.51 | v40.64,59.94 40.64,59.97 C19.2 v39.5,58.93 | v50.93,44.32 50.95,44.35 C21.2 | v52.07,43.31 C21.2 | C21.2 52.17,44.45 53.47,44.45 53.98,43.94 | v57.91,43.31 C20.2 59.03,44.35 v59.05,44.32 | v47.37,52.7 47.4,52.73 C28.2 v46.35,53.85 | v47.24,60.33 47.27,60.3 C27.2 v46.23,59.18 | U10.2 v50.29,56.52 | v18.03,52.83 19.43,52.83 v19.43,51.82 | v21.46,52.07 21.46,53.09
  Top 0.813: v23.88,26.92 C42.2
  Bottom 0.279: AUX<FB>CURR.1 103.08,6.77 v103,6.86
  other vias: 75.31,24.51 75.31,23.37 73.03,29.08 71.88,29.08 75.31,29.08 74.17,29.08 74.17,23.37 73.03,23.37 71.88,23.37 75.31,26.8 75.31,25.65 75.31,27.94 28.7,44.45 28.7,43.43 28.7,45.47 27.69,44.45 27.69,43.43 110.62,57.53 106.05,48.39 82.8,62.74 84.07,62.74 84.07,61.47 82.8,61.47 82.8,60.2 84.07,60.2 84.07,58.93 82.8,58.93 82.8,57.66 84.07,57.66 84.07,56.39 82.8,56.39 82.8,55.12 84.07,55.12 84.07,53.85 82.8,53.85 85.34,62.74 86.61,61.47 86.61,60.2 85.34,61.47 85.34,60.2 86.61,58.93 86.61,57.66 85.34,58.93 85.34,57.66 86.61,56.39 86.61,55.12 85.34,56.39 85.34,55.12 86.61,53.85 86.61,52.58 85.34,53.85 96.77,62.74 96.77,61.47 96.77,60.2 96.77,58.93 96.77,57.66 96.77,56.39 96.77,55.12 96.77,51.31 96.77,53.85 96.77,52.58 98.04,51.31 98.04,61.47 98.04,60.2 98.04,58.93 98.04,56.39 98.04,55.12 98.04,53.85 98.04,52.58 118.75,64.39 58.55,1.4 98.04,62.74 95.5,51.31 94.23,51.31 92.96,51.31 91.69,51.31 90.42,51.31 89.15,51.31 87.88,51.31 86.61,51.31 86.61,62.74 82.8,52.58 84.07,52.58 84.07,51.31 82.8,51.31 85.34,52.58 85.34,51.31 77.47,53.85 77.47,55.12 77.47,56.39 72.9,56.9 77.47,57.66 77.47,58.93 77.47,60.2 77.47,61.47 77.47,62.74 75.18,61.47 75.18,62.74 71.88,56.13 71.88,57.66 76.45,56.26 56.26,34.8 54.99,34.8 53.72,34.8 58.8,33.53 58.8,34.8 56.26,30.99 54.99,30.99 53.72,30.99 47.12,32 48.39,32 48.39,26.92 48.39,30.73 45.85,30.73 45.85,29.46 48.39,29.46 45.85,28.19 48.39,28.19 45.85,26.92 47.12,26.92 27.69,45.47 53.72,36.07 54.99,36.07 56.26,36.07 57.53,36.07 57.53,34.8 57.53,33.53 57.91,31.5 58.8,36.07 57.53,30.99 45.85,33.27 47.12,33.27 45.85,32 47.12,30.73 47.12,29.46 47.12,28.19 45.85,34.54 47.12,34.54 47.12,35.81 45.85,35.81 48.39,35.81 44.58,35.81 27.56,22.35 27.56,21.08 26.92,22.35 26.92,21.72 27.56,21.72 26.92,21.08 28.96,25.78 29.59,25.78 30.23,25.78 28.96,25.15 27.56,20.45 26.92,20.45 29.59,25.15 30.23,25.15 30.23,24.51 29.59,24.51 28.96,24.51 78.74,53.85 78.74,55.12 78.74,56.39 78.74,57.66 78.74,58.93 78.74,60.2 78.74,61.47 78.74,62.74 80.01,57.66 80.01,58.93 80.01,60.2 80.01,61.47 80.01,62.74 80.01,56.39 80.01,55.12 80.01,53.85 80.01,52.58 80.01,51.31 81.28,62.74 81.28,61.47 81.28,60.2 81.28,58.93 81.28,57.66 81.28,56.39 81.28,55.12 81.28,53.85 81.28,52.58 81.28,51.31 58.8,32.26 58.8,30.99 44.58,34.54 44.58,33.27 44.58,32 44.58,30.73 44.58,29.46 44.58,28.19 44.58,26.92 76.45,29.08 76.45,27.94 76.45,26.8 76.45,25.65 76.45,24.51 76.45,23.37 77.6,29.08 77.6,27.94 77.6,26.8 77.6,25.65 77.6,24.51 77.6,23.37
  pour Route2 (isolate 0.254, rank 3, no thermals): -2.54,82.55 127,82.55 127,-2.54 -2.54,-2.54
  pour Top (no thermals): 78.11,29.59 70.87,29.59 70.87,22.99 78.11,22.99
  pour Top (no thermals): 30.61,31.75 33.15,31.75 33.15,29.97 35.97,29.97 36.96,30.96 36.96,32.77 31.37,32.77 31.37,42.42 28.57,42.42 28.57,36.83 28.07,36.83 28.07,42.93 31.37,42.93 31.37,45.97 26.37,45.97 24.38,43.98 24.38,34.54 28.19,34.54 28.96,34.8 30.61,34.8
  pour Top (no thermals): 109.09,55.75 109.09,59.56 112.14,59.56 112.14,55.75
  pour Top (no thermals): 104.52,51.18 104.52,46.99 107.57,46.99 107.57,50.14 106.53,51.18
  pour Bottom: 98.55,63.5 98.55,50.8 77.22,50.8 77.22,63.5
  pour Top (no thermals): 71.63,55.88 71.63,57.91 73.91,57.91 73.91,60.71 74.68,60.71 74.68,63.5 98.55,63.5 98.55,50.8 80.14,50.8 77.47,48.13 74.68,48.13 74.68,55.88
  pour Top (no thermals): 53.21,36.83 59.31,36.83 59.31,30.48 49.66,30.48 49.66,26.16 43.81,26.16 43.81,36.83 49.66,36.83 49.66,31.24 52.2,31.24 52.2,32.77 53.21,32.77
  pour Top (no thermals): 28.83,26.67 30.35,26.67 30.35,25.91 30.23,25.78 28.96,25.78 28.83,25.91
  pour Top (no thermals): 23.88,22.73 23.88,20.37 24.69,19.56 30.1,19.56 30.1,22.35 30.48,23.11 30.48,24 29.72,24 29.72,23.24 29.21,22.73
  pour Bottom (no thermals): 78.11,29.59 70.87,29.59 70.87,22.99 78.11,22.99
IN  (via drill 0.33)
  Top 0.279: v82.68,32.26 84.71,30.23 90.68,30.23 91.95,28.96 91.95,19.56 100.58,10.92 v100.58,6.86
  Top 0.305: v82.93,38.1 83.95,38.1 84.18,37.87 U12.3
  Bottom 0.279: v100.58,6.86 AUX<FB>CURR.2
  Bottom 0.305: v82.68,32.26 82.68,37.85 v82.93,38.1
LDAC  (via drill 0.18)
  Top 0.127: J_LDAC3.1 J_LDAC2.1 J_LDAC1.1 J_LDAC0.2 15.39,47.37 v21.34,47.37 | v23.11,47.37 v26.29,50.55 | v27.56,56.13 U1.5
  Bottom 0.127: v21.34,47.37 v23.11,47.37 | v26.29,50.55 27.56,51.82 v27.56,56.13
LDAC0
  Top 0.127: J_LDAC0.1 10.67,43.94 9.53,42.8 9.53,26.29 UC.24
LDAC1
  Top 0.127: J_LDAC1.2 10.54,42.42 9.91,41.78 9.91,28.45 UC.25
LDAC2
  Top 0.127: J_LDAC2.2 10.79,40.89 10.29,40.39 10.29,30.61 UC.26
LDAC3
  Top 0.127: UC.27 10.9,32.54 J_LDAC3.2
LED+  (via drill 1.1)  (1 unrouted)
  Top 1.778: Q4.S 87.63,27.94 87.5,27.81 87.5,27.05
  Top 1.93: v59.18,7.62 53.47,7.62 EXPANSION.2 EXPANSION.1
  Top 2.794: v59.18,7.62 84.07,7.62
  Top 3.048: 84.07,7.62 86.61,10.16
  Top 3.81: 86.61,10.16 LED+.2 86.61,26.16 87.5,27.05
LED-  (via drill 1.1)  (1 unrouted)
  Top 0.279: 85.47,38.1 85.47,39.62 84.07,41.02 81.41,41.02 79.76,39.37 U15.10 72.77,39.37 70.23,41.91 U15.3
  Top 0.305: 85.28,36.45 85.47,36.64 85.47,37.29 U12.1 85.47,37.34 85.47,38.1
  Top 0.406: 85.28,36.45 82.87,36.45 | 82.87,36.45 82.68,36.26 | 82.74,36.26 82.87,36.39 82.87,36.45
  Top 0.813: 82.8,36.32 82.74,36.26 79.38,32.89 71.12,32.89 67.65,29.42 RSENSE.2
  Top 1.93: v59.18,13.21 52.3,13.21 50.93,11.84 EXPANSION.3 EXPANSION.4
  Top 2.54: 67.65,17.7 LED-.2
  Top 2.794: v59.18,13.21 65.02,13.21
  Top 3.048: 65.02,13.21 67.56,15.75
  Top 3.81: RSENSE.2 67.65,17.7 | 67.56,15.75 LED-.2
LED_ACTIVE  (via drill 0.33)
  Top 0.279: U6.8 56.01,42.98 v56.01,41.78 55.5,41.27 54.99,41.27 54.23,40.51 R23.2 | VREF<>TTL.P3 69.85,69.85 v65.66,65.66 | v64.39,64.39 64.39,62.23 64.77,61.85 64.77,49.78 60.71,45.72 v60.71,41.78
  Bottom 0.279: v65.66,65.66 v64.39,64.39 | v56.01,41.78 v60.71,41.78
MOSI
  Top 0.127: UC.11 7.37,33.02 7.37,37.08 6.86,37.59 6.86,42.42 7.62,43.18 8.13,43.18 8.38,43.43 8.38,44.47 12.17,48.26 21.65,48.26 24.38,51 24.38,53.59 24.77,53.98 27.2,53.98 27.56,53.62 U1.4
  Top 0.178: 27.69,52.39 U1.4
  Top 0.254: 27.44,52.57 U1.4 27.75,52.52
N$1
  Top 0.279: C2.1 20.61,60.02 R9.1
N$2
  Top 0.279: OC.A1 10.16,71.12 9.4,70.36 9.4,64.36 R26.1
N$3
  Top 0.279: IND.A1 5.08,71.12 4.06,70.1 4.06,64.36 R15.1
N$4
  Top 0.279: 91.19,44.81 91.19,45.21 90.93,45.47 90.93,46.13 | R45.2 88.14,46.23 87.63,45.72 87.63,44.41 88.35,43.69 U14.2
  Top 0.305: R45.2 90.93,46.23 | 91.03,46.23 R45.2 | 90.93,46.13 R45.2 | 91.19,44.81 U13.4
N$5
  Top 0.279: R20.1 37.31,59.52 U7.4 | R20.1 C18.1 | R20.1 38.96,57.78 R17.2
N$6
  Top 0.305: R32.2 REF_ADJ.3
N$8
  Top 0.279: 75.06,43.18 75.31,43.43 75.31,44.73 R36.1 R39.1
  Top 0.305: U15.13 75.06,43.18
N$9
  Top 0.279: OC.C1 10.16,73.66 8.89,72.39 8.89,60.33 8.13,59.56 Q1.D
N$10
  Top 0.279: 86.91,43.69 87.63,42.97 87.63,41.66 88.14,41.15 R46.1
  Top 0.305: R46.1 90.93,41.25 90.93,41.91 91.19,42.16 91.19,42.57 U13.6 | U14.5 86.91,43.69
N$11
  Top 0.279: R50.1 R49.1 70.48,44.68 70.48,43.69 69.98,43.18 U15.2
N$12
  Top 0.305: R13.1 R14.2 | U3.5 99.97,60.55
  Top 0.406: R13.1 99.97,60.55
N$13  (via drill 0.25)
  Top 0.279: 95.5,44.64 U11.1 96.25,44.58 v97.16,44.58 | 95.5,44.64 94.93,44.64 93.98,43.69 | R42.1 95.5,44.64 | U13.5 U13.2 | v98.93,43.69 100.1,43.69 C36.2
  Top 0.305: 93.98,43.69 U13.2
  Bottom 0.279: v97.16,44.58 98.04,43.69 v98.93,43.69
N$14
  Top 0.279: TEST.2 50.29,72.1 50.29,71.12 44.07,64.9 44.07,60.17 R10.1
  Top 0.305: 50.16,72.73 TEST.2 50.16,72.47
N$15
  Top 0.305: 77.23,38.23 R44.1 | U15.9 R44.1 | R43.1 77.36,37.92 R44.1
N$16
  Top 0.279: R30.1 12.45,65.02 OC.A2
N$18
  Top 0.279: U9.4 57.98,56.2 58.04,56.13 58.67,56.13 59.44,56.9 60.6,56.9 R33.1 R34.2
N$20
  Top 0.305: R31.2 54.23,56.8 U8.5
N$22
  Top 0.305: R31.1 52.78,57.19 REF_ADJ.2
N$24
  Top 0.279: R48.1 87.38,38.86 85.34,40.89 85.34,44.2 85.85,44.7 86.46,44.7 U14.4
N$25
  Top 0.279: R47.1 89.41,38.35 86.53,41.23 U14.6
N$26
  Top 0.279: R48.2 R47.2 R51.2 | Q4.G 89.65,35.22
  Top 0.305: 89.65,35.22 R47.2
N$27
  Top 0.279: R22.2 6.5,53.98 6.1,54.38 6.1,58.08 6.81,58.8 13.34,58.8 16.26,61.72 21.95,61.72 24.13,63.91 24.13,65.28 25.91,67.06 33.27,67.06 34.97,65.36 U7.1
N$28
  Top 0.279: Q1.G 5.15,55.84 R24.2 R22.1
N$32
  pour Top (no thermals): 31.88,33.27 31.88,36.83 36.96,36.83 36.96,33.27
N$33
  pour Top (no thermals): 31.88,37.34 31.88,42.42 37.97,42.42 37.97,37.34
N$34
  Top 0.279: VCTL<OFF>DAC.2 33.57,76.29 41.31,76.29 45.38,72.22 TEST.3
N$35
  Top 0.813: C9.1 R11.2 23.77,43.98 26.27,46.48 32.89,46.48 33.15,46.23 33.15,44.58 C11.1
  Top 1.27: L4.1 40.51,38.23
  pour Top (no thermals): 31.88,42.93 38.48,42.93 38.48,37.34 42.04,37.34 42.04,46.99 31.88,46.99
N$36
  pour Top (no thermals): 30.35,34.29 28.96,34.29 28.19,34.04 24.89,34.04 24.89,30.99 26.42,30.99 28.96,32.77 30.35,32.77
N$37
  Top 0.279: GAIN.2 37.08,73.66 40.13,70.61 48.01,70.61 48.9,71.5 48.9,73.53 49.66,74.3 53.09,74.3 61.47,65.91 64.01,65.91 68.2,61.72 68.2,50.55 71.02,47.73 R40.1
N$39
  Top 0.279: Q3.G 10.48,55.84 | 10.48,55.84 R29.2 | 10.48,55.84 10.48,54.06 R28.1
N$42
  Top 0.279: R21.1 57.81,40.21 R18.1 | R19.2 57.81,40.23 R18.1 | U6.2 55.32,45.52 56.64,44.2 56.64,43.43 57.78,42.29 57.78,40.54 R18.1
N$43
  Top 0.406: U4.2 74.04,52.17 arc90 R5.1 R52.2
N$46
  Top 0.279: R27.1 7.11,65.02 IND.A2
N$47  (via drill 0.33)
  Top 0.279: IND.C2 5.84,68.58 4.83,67.56 4.83,65.28 6.1,64.01 v6.1,61.09 | Q2.D 49.02,46.86 43.69,52.2 30.1,52.2 27.43,54.86 24.51,54.86 22.48,56.9 14.73,56.9 13.34,58.29 9.14,58.29 v8.89,58.04
  Bottom 0.279: v8.89,58.04 6.99,58.04 6.1,58.93 v6.1,61.09
N$49
  Top 0.279: R23.1 R25.2 50.1,40.43 50.1,40.45 Q2.G
N$51
  Top 0.279: C15.1 50.57,29.55 U5.4
N$52
  Top 0.406: R4.1 81.99,67.44 VAUX_OUT.1
N$54
  Top 0.406: VI.1 95.56,67.49 R6.1
N$55
  Top 0.406: R7.1 115.52,67.44 VREF.1
N$56
  Top 0.254: 27.16,26.92 C42.1
  Top 0.813: 27.16,26.92 28.07,26.92 28.07,26.42
  pour Top (no thermals): 27.81,25.78 27.81,26.54 28.45,26.54 28.45,25.78
N$58
  Top 0.127: J_VI3.2 J_VI2.2 J_VI1.2 J_VI0.2 21.11,44.6 24.64,48.13 29.57,48.13 L1.1
NOGND
  cutout Route2: 24.77,3.17 36.83,3.17 40.01,6.35 114.41,6.35 116.2,8.15 116.2,17.78 116.84,17.78 116.84,8 114.55,5.71 40.64,5.71 37.47,2.54 24.13,2.54 24.13,11.43 29.21,16.51 33.02,16.51 43.18,26.67 43.18,51.44 43.81,51.44 43.81,26.04 33.66,15.88 29.84,15.88 24.77,10.79
NOPLANE
  cutout Bottom (no thermals): 95.5,45.09 95.5,42.29 99.57,42.29 99.57,45.09
  cutout Route2 (no thermals): 95.5,45.09 95.5,42.29 99.57,42.29 99.57,45.09
  cutout Route15 (no thermals): 95.5,45.09 95.5,42.29 99.57,42.29 99.57,45.09
OC
  Top 0.279: OC.C2 13.84,66.17 13.84,60.33 13.08,59.56 Q3.D
OC0
  Top 0.127: J_OC0.2 16.76,43.94 15.62,42.8 15.62,34.8 17.91,32.51 17.91,18.16 UC.A13
OC1
  Top 0.127: J_OC1.2 16.76,42.42 16,41.66 16,34.8 18.29,32.51 18.29,16.26 17.27,15.24 14.48,15.24 13.97,15.75 UC.A12
OC2
  Top 0.127: J_OC2.2 16.76,40.89 16.38,40.51 16.38,34.8 18.67,32.51 18.67,15.88 17.53,14.73 17.53,13.21 UC.A10
OC3
  Top 0.127: UC.A11 19.05,32.51 16.76,34.8 16.76,39.14 J_OC3.2
OVER_CURR  (via drill 0.18)
  Top 0.127: U10.6 47.03,55.54 v46.35,54.86 | L2.1 33.91,51.54 34.29,51.54 v34.29,51.56
  Bottom 0.127: v46.35,54.86 45.59,54.1 45.59,53.09 44.07,51.56 v34.29,51.56
OVER_CURR_PRE  (via drill 0.18)
  Top 0.127: J_OC0.1 J_OC1.1 J_OC2.1 J_OC3.1 18.06,37.85 arc-90 R8.1 | v18.03,46.86 18.03,43.97 J_OC0.1 | v19.94,45.09 19.2,45.09 J_OC0.1 | v22.48,45.09 25.15,47.75 31.85,47.75 L2.2 | R28.2 12.95,53.98 v18.03,48.9
  Bottom 0.127: v18.03,48.9 v18.03,46.86 | v22.48,45.09 v19.94,45.09
POW_IN  (via drill 2.2 pad 0.33)
  Top 4.445: POWER.1 105.35,12 v99.82,17.53
REF2.5  (via drill 0.8 pad 0.3)
  Top 0.279: C3.1
  Top 0.305: 56.16,59.34 REF_ADJ.1 | 56.16,56.9 U8.4
  Top 0.406: U1.6 26.29,59.94 26.92,60.58 C3.1
  Top 0.61: U8.4 56.16,58.67 | 56.16,58.67 56.16,59.34 | REF_ADJ.1 55.49,59.82 54.23,61.09 54.23,62.87 52.83,64.26 REF2V5.1 | U9.3 56.21,58.63 56.16,58.67 | v45.59,64.26 REF2V5.1 | v33.66,64.26 31.36,64.26 28.45,61.35 C3.1 | REF2V5.1
  Bottom 0.61: v45.59,64.26 v33.66,64.26
REF5.0  (via drill 0.33)
  Top 0.279: R34.1 60.81,61.32 59.88,60.39 U9.1 59.82,58.57 59.82,57.78 v59.69,57.66 | 39.5,55.37 R17.1 41.55,53.47 44.58,53.47 46.1,51.94 50.55,51.94 51.44,52.83 v51.44,57.02
  Top 0.305: 52.71,72.39 TEST.1 | C26.1 61.37,63.48
  Top 0.61: TEST.1 52.71,72.16 C26.1 61.37,61.32 R34.1 63.88,61.32 63.88,60.83 REF5V0.1 63.88,50.19 59.82,46.12 59.82,40.79 R18.2
  Bottom 0.279: v59.69,57.66 52.07,57.66 v51.44,57.02
SCL  (via drill 0.18, 1.1)
  Top 0.127: EXPANSION.8 v45.85,1.91 24.51,1.91 23.88,2.54 23.88,13.08 25.4,14.61 25.4,16.92 R2.2 23.11,17.78 UC.19/A5 | v48.64,1.91 56.77,1.91 58.29,3.43 v61.09,3.43
  Bottom 0.127: v45.85,1.91 v48.64,1.91
SCLK
  Top 0.127: UC.14/A0 20.57,33.02 20.57,45.59 26.29,51.31 U1.3
  Top 0.178: 26.42,52.39 U1.3
SDA  (via drill 1.1)
  Top 0.127: UC.18/A4 20.45,20.7 20.45,18.67 21.08,18.03 22.11,18.03 23.37,16.78 23.37,15.49 | R3.2 23.37,15.49 | 23.37,15.49 23.37,2.35 24.45,1.27 47.12,1.27 48.39,2.54 48.39,4.83 | 48.39,4.83 EXPANSION.6 | v58.55,4.95 58.42,4.83 48.39,4.83
SW
  pour Top (no thermals): 30.73,24.26 31.88,23.11 36.7,23.11 36.7,25.53 30.73,25.53
T0
  Top 0.127: J_T0.1 4.57,43.94 3.3,42.67 3.3,14.73 UC.3
T1
  Top 0.127: J_T1.1 4.8,42.39 3.68,41.27 3.68,16.89 UC.4
T2
  Top 0.127: J_T2.1 4.8,40.87 4.06,40.13 4.06,19.05 UC.5
T3
  Top 0.127: J_T3.1 4.83,39.37 4.45,38.99 4.45,21.21 4.83,20.83 UC.6
TEENSY_VIN  (via drill 1)
  Top 1.016: D2.C 28.93,16.61 v28.07,15.75
  Bottom 1.016: UC.VIN 23.5,3.43 23.5,11.18 v28.07,15.75
TRIG
  Top 0.127: J_T0.2 J_T1.2 J_T2.2 J_T3.2 5.87,39.01 4.83,37.97 4.83,21.72 5.97,20.57 6.73,20.57 13.97,13.34 TRIG.1
VAUX
  Top 0.279: U12.4 82.02,37.31 80.01,35.31 72.9,35.31 70.48,37.72 70.48,38.23 69.34,39.37 U15.5 66.93,39.37 64.64,37.08 64.64,27.15 60.73,23.24 56.13,23.24 EXPANSION.9 39.98,10.41 D6.C D5.A 37.13,10.69 R35.1 | R35.1 34.95,10.54 | VAUX_IN.1 32.56,10.69 R35.1
  Top 0.305: 34.77,10.69 R35.1
VAUX_OUT  (via drill 0.33)
  Top 0.279: U15.7 v65.66,36.83 | v63.63,36.83 61.59,38.86 61.59,45.34 65.41,49.15 65.41,62.87 v65.66,63.12 | R4.2 69.98,67.44 v66.8,64.26
  Top 0.305: U15.6 U15.7
  Bottom 0.279: v65.66,36.83 v63.63,36.83 | v65.66,63.12 v66.8,64.26
VCTL
  Top 0.279: U10.4 45.38,57.47 R37.2 R10.2 44.93,61.34 D3.C VPRE.1
VCTL_PROT
  Top 0.279: U10.5 46.23,56.52 45.72,56.01 45.72,54.86 45.47,54.61 R38.2 44.45,54.61 44.2,54.86 44.2,55.75 43.2,56.74 R37.1
VCTL_PROTECT
  Top 0.279: GAIN.3 34.54,73.91 41.4,67.06 41.4,56.64 43.2,54.84 R38.1
VI  (via drill 0.33)
  Top 0.254: 70.23,40.82 69.77,41.27
  Top 0.279: 70.23,40.82 70.23,39.62 73.03,36.83 U15.8 76.73,36.83 R43.2 | 69.77,41.27 67.29,41.27 66.93,41.63 66.93,44.32 64.9,46.35 64.9,47.5 65.91,48.51 65.91,60.83 v66.93,61.85 | v68.2,63.12 70.36,65.28 90.04,65.28 R6.2
  Top 0.305: 73.79,36.78 U15.8
  Bottom 0.279: v66.93,61.85 v68.2,63.12
VI0
  Top 0.127: J_VI0.1 19.81,43.94 18.67,42.8 18.67,33.27 19.43,32.51 19.43,15.88 20.32,14.99 20.32,12.95 UC.22/A8
VI1
  Top 0.127: J_VI1.1 19.81,42.42 19.05,41.66 19.05,33.27 19.81,32.51 19.81,26.16 UC.17/A3
VI2
  Top 0.127: J_VI2.1 19.81,40.89 19.43,40.51 19.43,33.27 20.19,32.51 20.19,28.32 UC.16/A2
VI3
  Top 0.127: UC.15/A1 20.57,30.48 20.57,32.51 19.81,33.27 19.81,39.14 J_VI3.1
VI_INTERNAL  (via drill 0.33)
  Top 0.279: R16.2 R1.1 33.15,56.11 33.15,55.63 33.91,54.86 34.42,54.86 34.92,54.36 37.47,54.36 38.86,52.96 44.19,52.96 48.38,48.77 54.66,48.77 | U15.1 68.17,44.45 66.95,45.67 R49.2 66.7,46.74 v65.66,46.74 | v61.09,48.77 54.66,48.77 | U6.3 54.66,48.77
  Bottom 0.279: v65.66,46.74 63.12,46.74 v61.09,48.77
VI_LP  (via drill 0.18)
  Top 0.127: v30.1,53.85 C1.1 | L1.2 30.1,50.65 v30.1,51.44
  Top 0.279: C1.1 31.39,54.15 R1.2
  Bottom 0.127: v30.1,51.44 v30.1,53.85
VINPUT
  Top 0.279: VCTL<OFF>DAC.3 29.58,77 43.9,77 45.21,75.69 57.58,75.69 58.93,74.34 58.93,70.33 61.77,67.49 VCTL.1
VREF
  Top 0.279: 73.91,44.52 75.34,45.95 R36.2 74.07,47.75 71.88,47.75 69.34,50.29 69.34,62.87 70.61,64.14 92.58,64.14 94.11,65.66 105.31,65.66 VREF<>TTL.P1
  Top 0.305: 73.91,44.52 U15.14
VREF/TTL
  Top 0.406: VREF<>TTL.P2 109.22,67.31 R7.2
~LED_ACTIVE
  Top 0.279: R21.2 57.66,38.48 56.77,39.37 53.29,39.37 52.83,39.83 52.83,41.24 53.37,41.78 55.32,41.78 U6.7

## Text on the board
tPlace: GAIN | DISABLE | DAC | VCTL | TEST | +13.3V | GND | (DNP) | (DNP) | (DNP) | (DNP) | BRD-ADDR | TRIG | CS | LDAC | SENSE | OC | VI | 0 | 1 | 2 | 3 | (DNP) | 0 Ohm | Cyclops Rev. 3.6 / CC BY-SA-NC 4.0 / Jon Newman / 2016 | S0 | S1 | PANEL SWITCH. / SHORT IF NOT / IN USE. | LED- | LED+ | SDA | SCL | DGND | AUX | CURR
bPlace: DAC<OFF>VCTL | +13.3V | GND | Cyclops / Rev. 3.6 | LED- | LED+ | ヽ(´ー｀)ノ | CC BY-SA-NC 4.0 / Jon Newman / 2015 | SDA | SCL | DGND